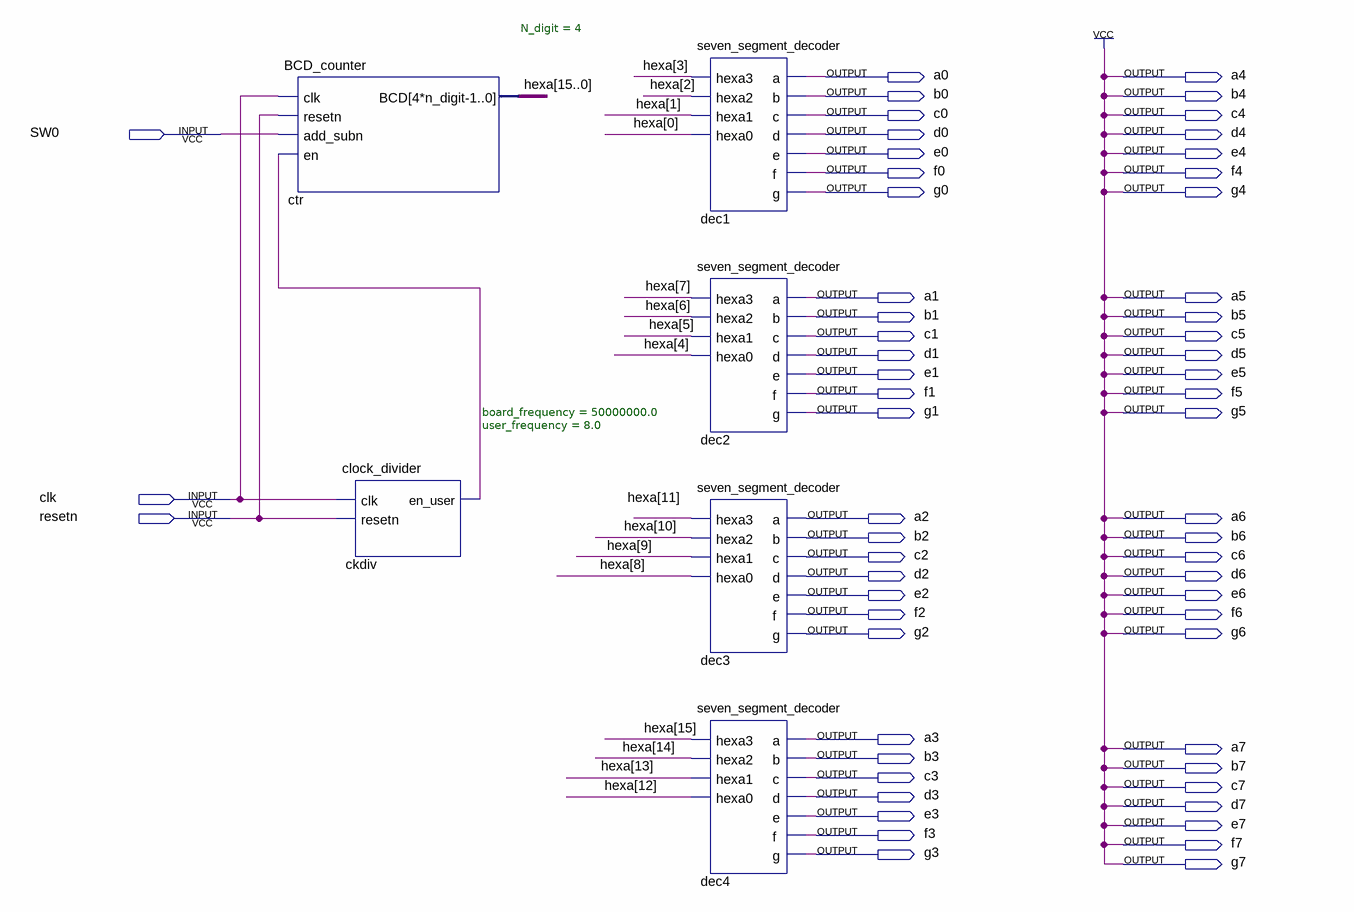
[diagram p0: schematic sheet]
// Quartus schematic demo.bdf as structural Verilog: 6 symbols, 59 pins
module demo (
  input  SW0,
  input  clk,
  input  resetn,
  output a0,
  output a4,
  output b0,
  output b4,
  output c0,
  output c4,
  output d0,
  output d4,
  output e0,
  output e4,
  output f0,
  output f4,
  output g0,
  output g4,
  output a1,
  output a5,
  output b1,
  output b5,
  output c1,
  output c5,
  output d1,
  output d5,
  output e1,
  output e5,
  output f1,
  output f5,
  output g1,
  output g5,
  output a2,
  output a6,
  output b2,
  output b6,
  output c2,
  output c6,
  output d2,
  output d6,
  output e2,
  output e6,
  output f2,
  output f6,
  output g2,
  output g6,
  output a3,
  output a7,
  output b3,
  output b7,
  output c3,
  output c7,
  output d3,
  output d7,
  output e3,
  output e7,
  output f3,
  output f7,
  output g3,
  output g7
);

  wire ckdiv_en_user;
  wire [15:0] hexa;

  BCD_counter #(.N_digit(4)) ctr (.clk(clk), .resetn(resetn), .add_subn(SW0), .en(ckdiv_en_user), .BCD(hexa));
  clock_divider #(.board_frequency(50000000.0), .user_frequency(8.0)) ckdiv (
    .clk(clk), .resetn(resetn), .en_user(ckdiv_en_user));
  seven_segment_decoder dec1 (
    .hexa3(hexa[3]), .hexa2(hexa[2]), .hexa1(hexa[1]), .hexa0(hexa[0]), .a(a0), .b(b0), .c(c0), .d(d0),
    .e(e0), .f(f0), .g(g0));
  seven_segment_decoder dec2 (
    .hexa3(hexa[7]), .hexa2(hexa[6]), .hexa1(hexa[5]), .hexa0(hexa[4]), .a(a1), .b(b1), .c(c1), .d(d1),
    .e(e1), .f(f1), .g(g1));
  seven_segment_decoder dec3 (
    .hexa3(hexa[11]), .hexa2(hexa[10]), .hexa1(hexa[9]), .hexa0(hexa[8]), .a(a2), .b(b2), .c(c2), .d(d2),
    .e(e2), .f(f2), .g(g2));
  seven_segment_decoder dec4 (
    .hexa3(hexa[15]), .hexa2(hexa[14]), .hexa1(hexa[13]), .hexa0(hexa[12]), .a(a3), .b(b3), .c(c3), .d(d3),
    .e(e3), .f(f3), .g(g3));

  assign a4 = 1'b1;
  assign a5 = 1'b1;
  assign a6 = 1'b1;
  assign a7 = 1'b1;
  assign b4 = 1'b1;
  assign b5 = 1'b1;
  assign b6 = 1'b1;
  assign b7 = 1'b1;
  assign c4 = 1'b1;
  assign c5 = 1'b1;
  assign c6 = 1'b1;
  assign c7 = 1'b1;
  assign d4 = 1'b1;
  assign d5 = 1'b1;
  assign d6 = 1'b1;
  assign d7 = 1'b1;
  assign e4 = 1'b1;
  assign e5 = 1'b1;
  assign e6 = 1'b1;
  assign e7 = 1'b1;
  assign f4 = 1'b1;
  assign f5 = 1'b1;
  assign f6 = 1'b1;
  assign f7 = 1'b1;
  assign g4 = 1'b1;
  assign g5 = 1'b1;
  assign g6 = 1'b1;
  assign g7 = 1'b1;
endmodule
